# EAGLE schematic BMS_Slave (EAGLE 7.2.0)

## Sheet 1 of 5
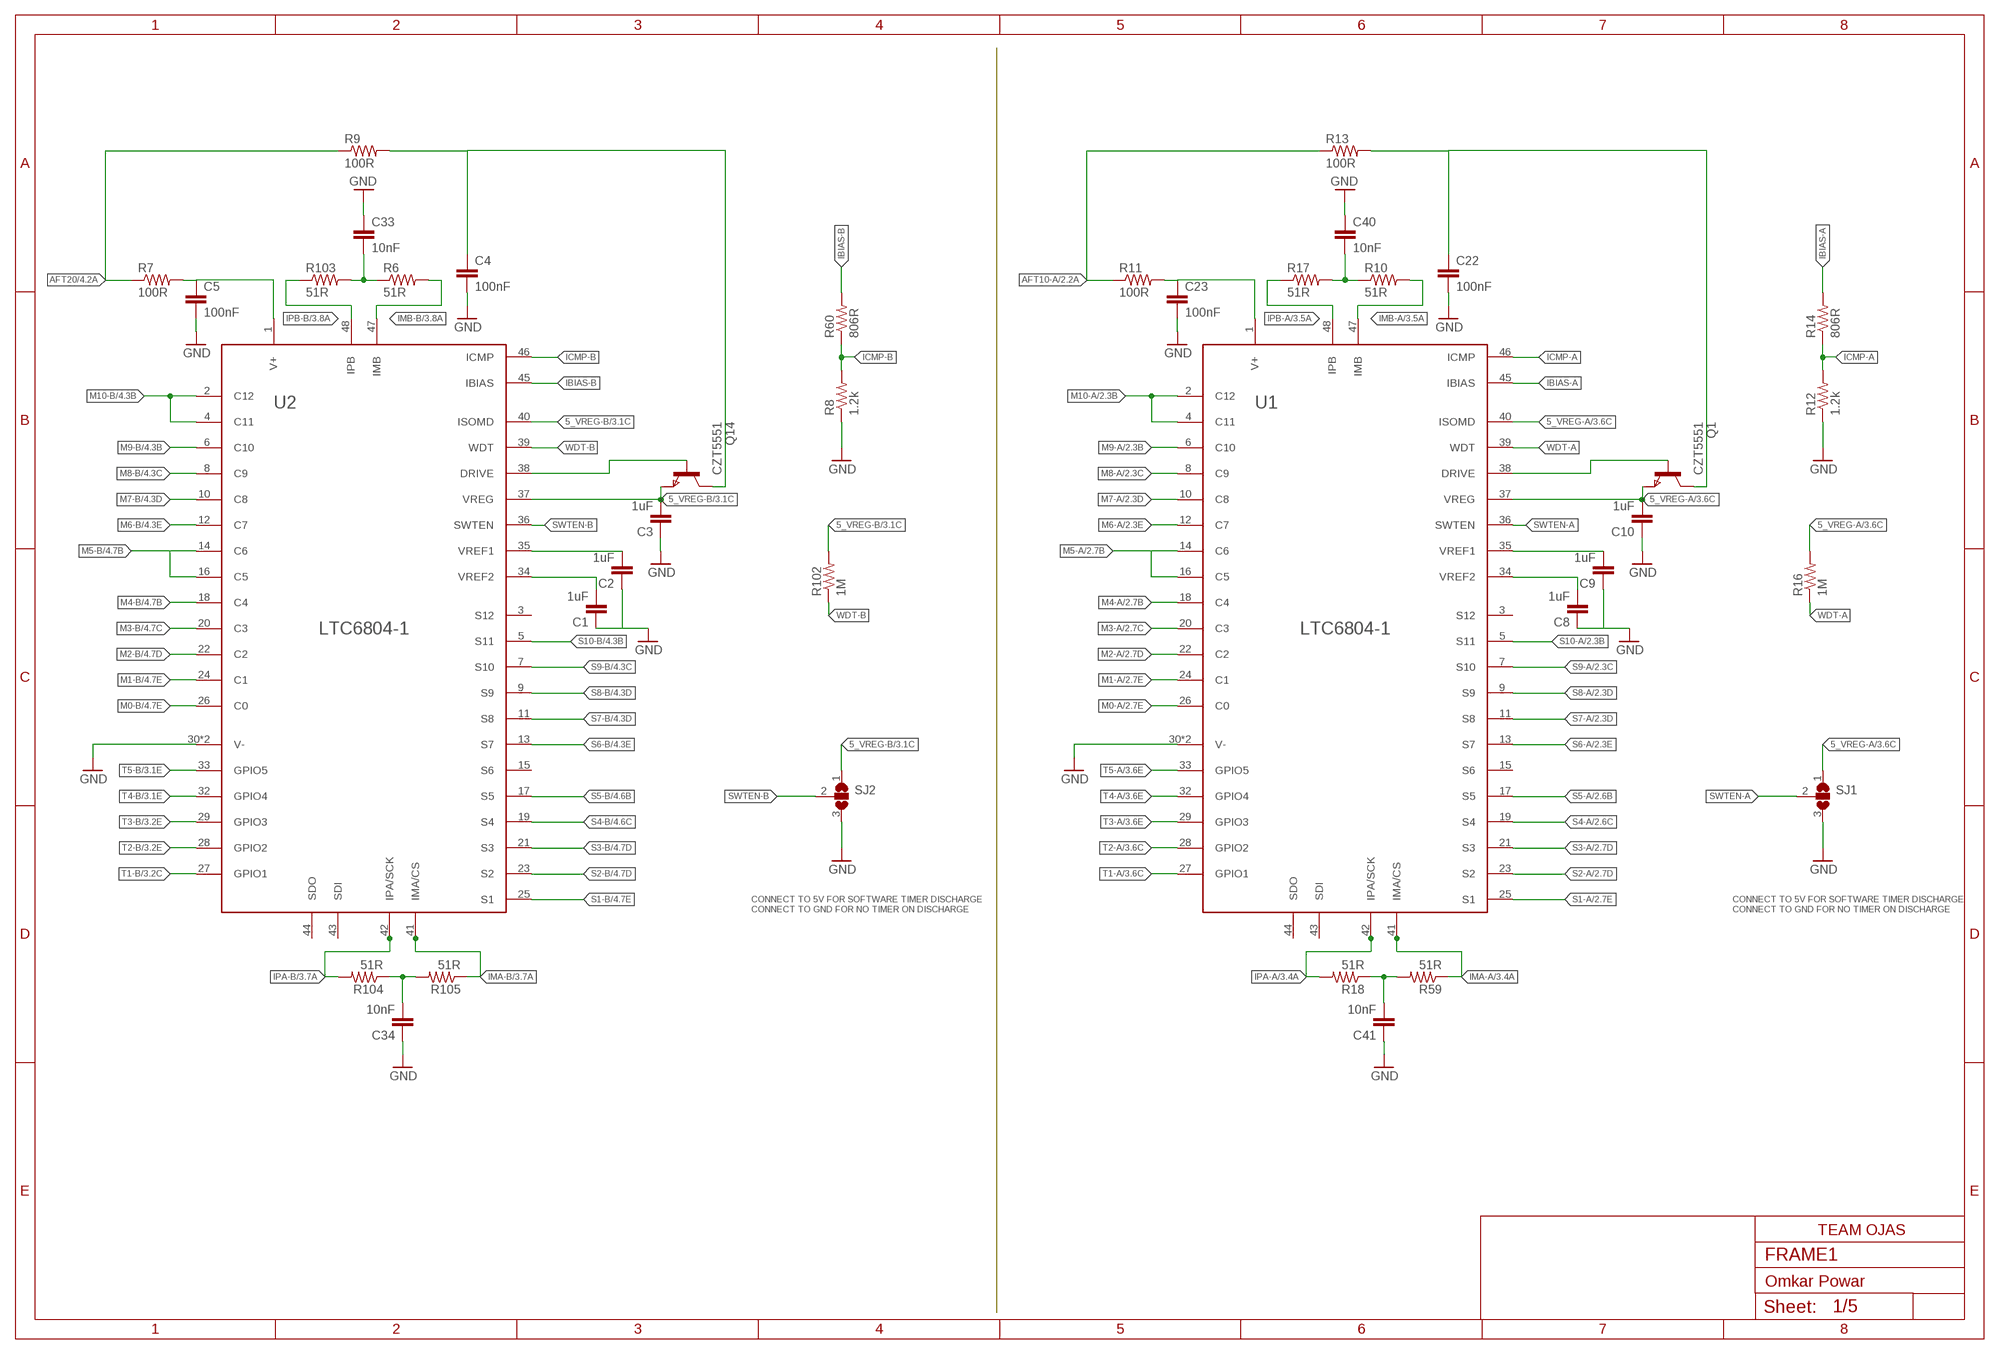
[diagram p0: schematic, sheet 1]

### Parts
C1  1uF  C0603  [0603]
C2  1uF  C0603  [0603]
C3  1uF  C0603  [0603]
C4  100nF  C0805  [0805]
C5  100nF  C0805  [0805]
C8  1uF  C0603  [0603]
C9  1uF  C0603  [0603]
C10  1uF  C0603  [0603]
C22  100nF  C0805  [0805]
C23  100nF  C0805  [0805]
C33  10nF  C0805  [0805]
C34  10nF  C0805  [0805]
C40  10nF  C0805  [0805]
C41  10nF  C0805  [0805]
Q1  CZT5551  NSV1C201MZ4  [SOT223]
Q14  CZT5551  NSV1C201MZ4  [SOT223]
R6  51R  R0603  [0603]
R7  100R  R0603  [0603]
R8  1.2k  R0603  [0603]
R9  100R  R0603  [0603]
R10  51R  R0603  [0603]
R11  100R  R0603  [0603]
R12  1.2k  R0603  [0603]
R13  100R  R0603  [0603]
R14  806R  R0603  [0603]
R16  1M  R0603  [0603]
R17  51R  R0603  [0603]
R18  51R  R0603  [0603]
R59  51R  R0603  [0603]
R60  806R  R0603  [0603]
R102  1M  R0603  [0603]
R103  51R  R0603  [0603]
R104  51R  R0603  [0603]
R105  51R  R0603  [0603]
SJ1  SJ2W  [SJ_2]
SJ2  SJ2W  [SJ_2]
U1  LTC6804  [48-LEAD_SSOP]
U2  LTC6804  [48-LEAD_SSOP]

### Nets
5_VREG-A: C10.P$2 Q1.3(E) R16.P$2 SJ1.1 U1.37(VREG) U1.40(ISOMD) ; also sheet 3
5_VREG-B: C3.P$2 Q14.3(E) R102.P$2 SJ2.1 U2.37(VREG) U2.40(ISOMD) ; also sheet 3
AFT10-A: R11.P$1 R13.P$1 ; also sheet 2
AFT20: R7.P$1 R9.P$1 ; also sheet 4
GNDA: C8.P$1 C9.P$1 C10.P$1 C22.P$2 C23.P$2 C40.P$1 C41.P$1 R12.P$1 SJ1.3 U1.30(V-) U1.31(V-) ; supply symbol labelled GND ; also sheet 2,3
GNDB: C1.P$1 C2.P$1 C3.P$1 C4.P$2 C5.P$2 C33.P$1 C34.P$1 R8.P$1 SJ2.3 U2.30(V-) U2.31(V-) ; supply symbol labelled GND ; also sheet 3,4
IBIAS-A: R14.P$2 U1.45(IBIAS)
IBIAS-B: R60.P$2 U2.45(IBIAS)
ICMP-A: R12.P$2 R14.P$1 U1.46(ICMP)
ICMP-B: R8.P$2 R60.P$1 U2.46(ICMP)
IMA-A: R59.P$1 U1.41(IMA/CS) ; also sheet 3
IMA-B: R105.P$1 U2.41(IMA/CS) ; also sheet 3
IMB-A: R10.P$2 U1.47(IMB) ; also sheet 3
IMB-B: R6.P$2 U2.47(IMB) ; also sheet 3
IPA-A: R18.P$2 U1.42(IPA/SCK) ; also sheet 3
IPA-B: R104.P$2 U2.42(IPA/SCK) ; also sheet 3
IPB-A: R17.P$1 U1.48(IPB) ; also sheet 3
IPB-B: R103.P$1 U2.48(IPB) ; also sheet 3
M0-A: U1.26(C0) ; also sheet 2
M0-B: U2.26(C0) ; also sheet 4
M1-A: U1.24(C1) ; also sheet 2
M1-B: U2.24(C1) ; also sheet 4
M2-A: U1.22(C2) ; also sheet 2
M2-B: U2.22(C2) ; also sheet 4
M3-A: U1.20(C3) ; also sheet 2
M3-B: U2.20(C3) ; also sheet 4
M4-A: U1.18(C4) ; also sheet 2
M4-B: U2.18(C4) ; also sheet 4
M5-A: U1.14(C6) U1.16(C5) ; also sheet 2
M5-B: U2.14(C6) U2.16(C5) ; also sheet 4
M6-A: U1.12(C7) ; also sheet 2
M6-B: U2.12(C7) ; also sheet 4
M7-A: U1.10(C8) ; also sheet 2
M7-B: U2.10(C8) ; also sheet 4
M8-A: U1.8(C9) ; also sheet 2
M8-B: U2.8(C9) ; also sheet 4
M9-A: U1.6(C10) ; also sheet 2
M9-B: U2.6(C10) ; also sheet 4
M10-A: U1.2(C12) U1.4(C11) ; also sheet 2
M10-B: U2.2(C12) U2.4(C11) ; also sheet 4
N$1: C5.P$1 R7.P$2 U2.1(V+)
N$2: C9.P$2 U1.35(VREF1)
N$3: C8.P$2 U1.34(VREF2)
N$11: Q14.1(B) U2.38(DRIVE)
N$12: C4.P$1 Q14.2(C) Q14.4(C) R9.P$2
N$15: C2.P$2 U2.35(VREF1)
N$16: C1.P$2 U2.34(VREF2)
N$17: C33.P$2 R6.P$1 R103.P$2
N$18: C40.P$2 R10.P$1 R17.P$2
N$19: C34.P$2 R104.P$1 R105.P$2
N$20: C41.P$2 R18.P$1 R59.P$2
N$36: Q1.1(B) U1.38(DRIVE)
N$49: C22.P$1 Q1.2(C) Q1.4(C) R13.P$2
N$66: C23.P$1 R11.P$2 U1.1(V+)
S1-A: U1.25(S1) ; also sheet 2
S1-B: U2.25(S1) ; also sheet 4
S2-A: U1.23(S2) ; also sheet 2
S2-B: U2.23(S2) ; also sheet 4
S3-A: U1.21(S3) ; also sheet 2
S3-B: U2.21(S3) ; also sheet 4
S4-A: U1.19(S4) ; also sheet 2
S4-B: U2.19(S4) ; also sheet 4
S5-A: U1.17(S5) ; also sheet 2
S5-B: U2.17(S5) ; also sheet 4
S6-A: U1.13(S7) ; also sheet 2
S6-B: U2.13(S7) ; also sheet 4
S7-A: U1.11(S8) ; also sheet 2
S7-B: U2.11(S8) ; also sheet 4
S8-A: U1.9(S9) ; also sheet 2
S8-B: U2.9(S9) ; also sheet 4
S9-A: U1.7(S10) ; also sheet 2
S9-B: U2.7(S10) ; also sheet 4
S10-A: U1.5(S11) ; also sheet 2
S10-B: U2.5(S11) ; also sheet 4
SWTEN-A: SJ1.2 U1.36(SWTEN)
SWTEN-B: SJ2.2 U2.36(SWTEN)
T1-A: U1.27(GPIO1) ; also sheet 3
T1-B: U2.27(GPIO1) ; also sheet 3
T2-A: U1.28(GPIO2) ; also sheet 3
T2-B: U2.28(GPIO2) ; also sheet 3
T3-A: U1.29(GPIO3) ; also sheet 3
T3-B: U2.29(GPIO3) ; also sheet 3
T4-A: U1.32(GPIO4) ; also sheet 3
T4-B: U2.32(GPIO4) ; also sheet 3
T5-A: U1.33(GPIO5) ; also sheet 3
T5-B: U2.33(GPIO5) ; also sheet 3
WDT-A: R16.P$1 U1.39(WDT)
WDT-B: R102.P$1 U2.39(WDT)
Unconnected: U1.3(S12) U1.15(S6) U1.43(SDI) U1.44(SDO) U2.3(S12) U2.15(S6) U2.43(SDI) U2.44(SDO)

### Notes on the sheet
- CONNECT TO 5V FOR SOFTWARE TIMER DISCHARGE
  CONNECT TO GND FOR NO TIMER ON DISCHARGE
- CONNECT TO 5V FOR SOFTWARE TIMER DISCHARGE
  CONNECT TO GND FOR NO TIMER ON DISCHARGE

## Sheet 2 of 5
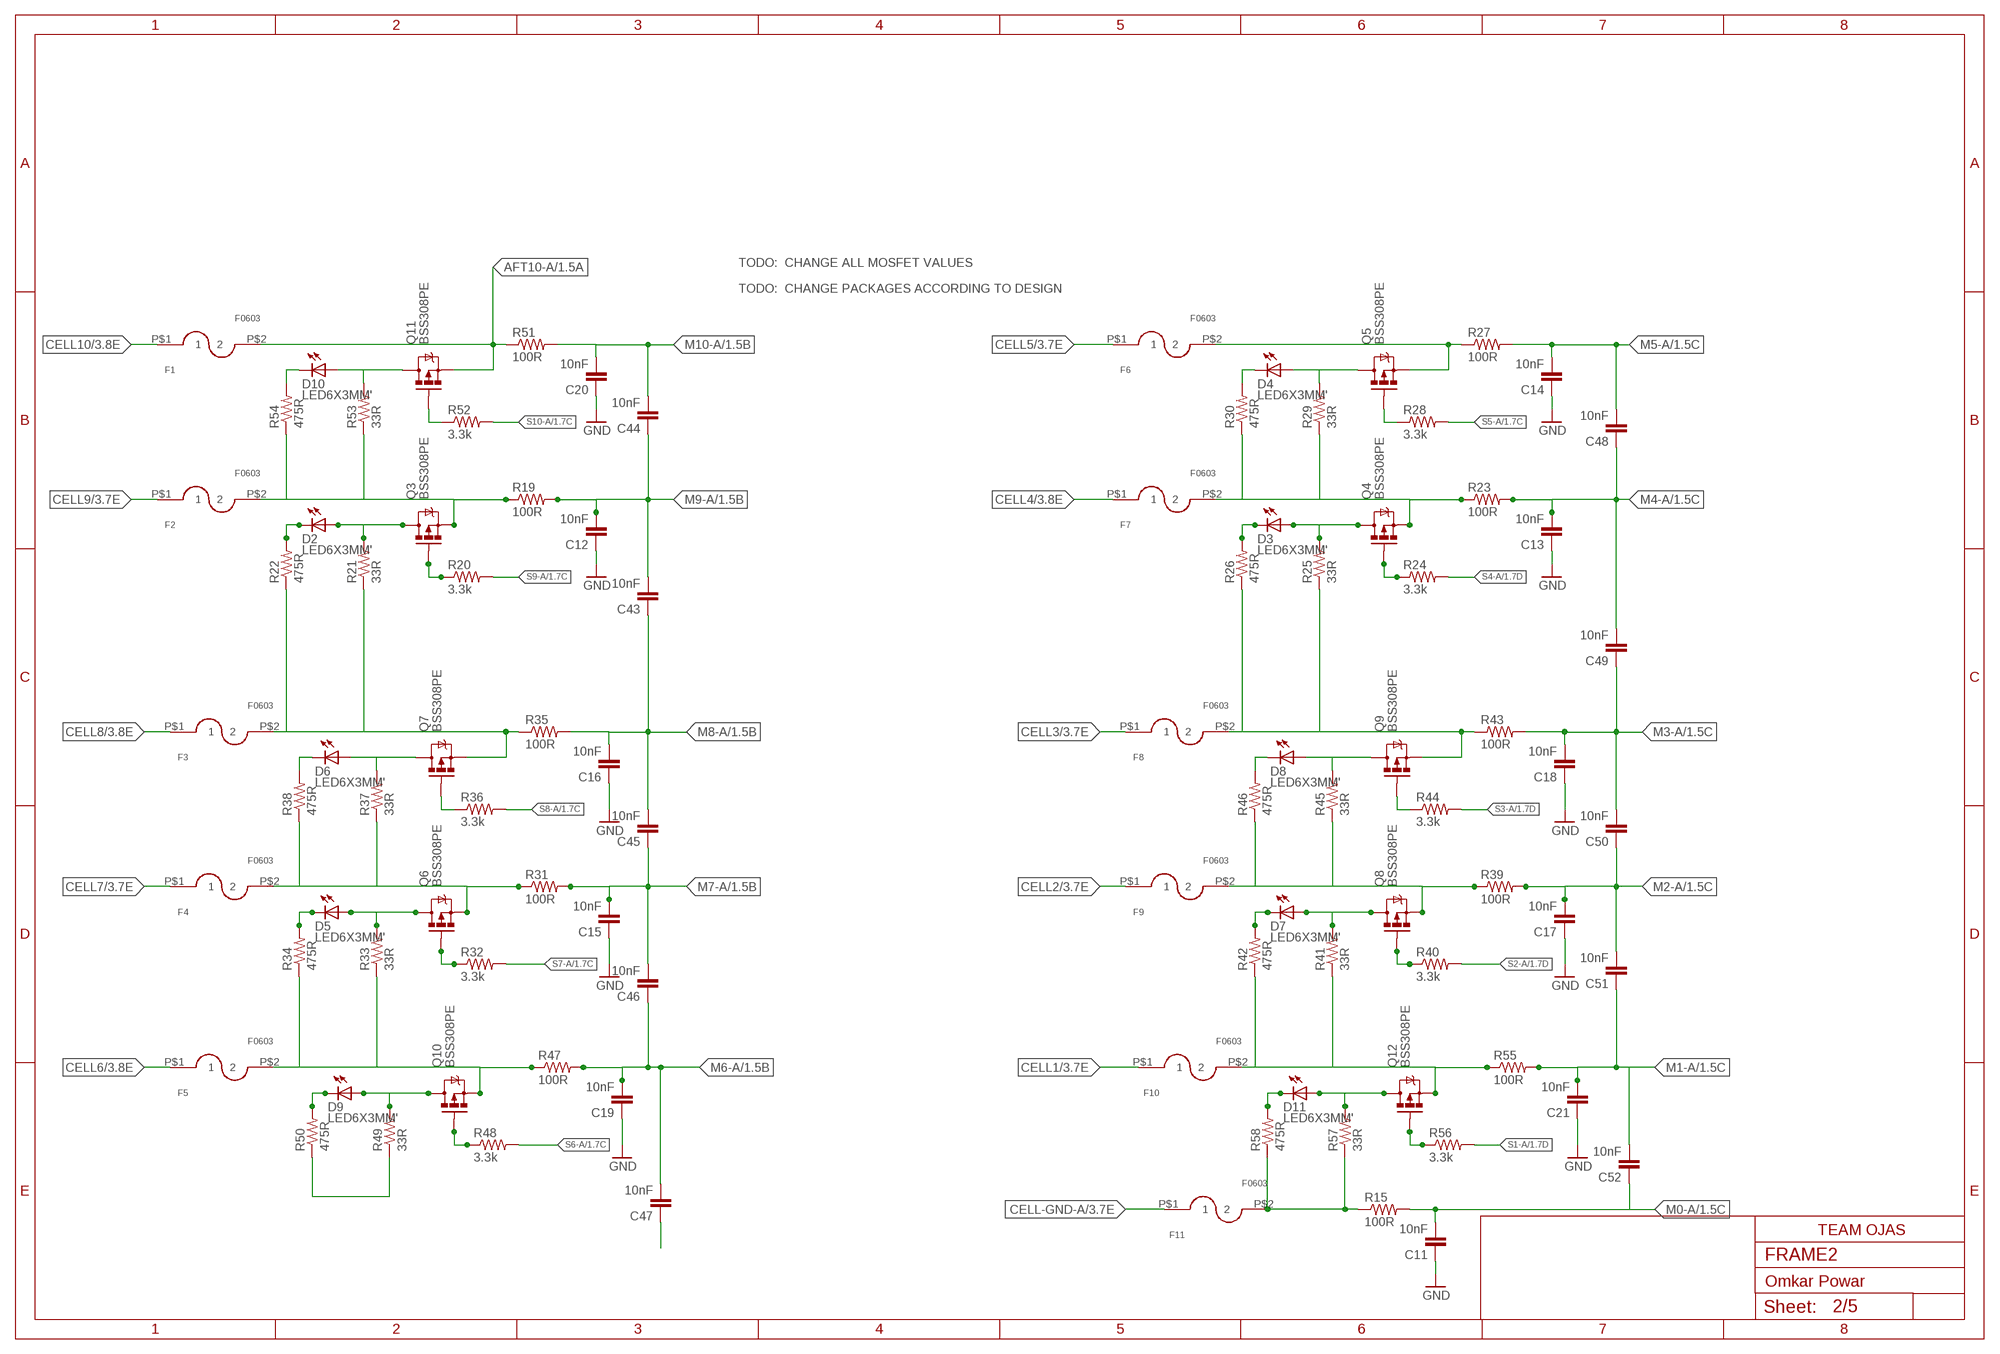
[diagram p1: schematic, sheet 2]

### Parts
C11  10nF  C0603  [0603]
C12  10nF  C0603  [0603]
C13  10nF  C0603  [0603]
C14  10nF  C0603  [0603]
C15  10nF  C0603  [0603]
C16  10nF  C0603  [0603]
C17  10nF  C0603  [0603]
C18  10nF  C0603  [0603]
C19  10nF  C0603  [0603]
C20  10nF  C0603  [0603]
C21  10nF  C0603  [0603]
C43  10nF  C0603  [0603]
C44  10nF  C0603  [0603]
C45  10nF  C0603  [0603]
C46  10nF  C0603  [0603]
C47  10nF  C0603  [0603]
C48  10nF  C0603  [0603]
C49  10nF  C0603  [0603]
C50  10nF  C0603  [0603]
C51  10nF  C0603  [0603]
C52  10nF  C0603  [0603]
D2  LED6X3MM'  [LED0603]
D3  LED6X3MM'  [LED0603]
D4  LED6X3MM'  [LED0603]
D5  LED6X3MM'  [LED0603]
D6  LED6X3MM'  [LED0603]
D7  LED6X3MM'  [LED0603]
D8  LED6X3MM'  [LED0603]
D9  LED6X3MM'  [LED0603]
D10  LED6X3MM'  [LED0603]
D11  LED6X3MM'  [LED0603]
F1  F0603  [0603]
F2  F0603  [0603]
F3  F0603  [0603]
F4  F0603  [0603]
F5  F0603  [0603]
F6  F0603  [0603]
F7  F0603  [0603]
F8  F0603  [0603]
F9  F0603  [0603]
F10  F0603  [0603]
F11  F0603  [0603]
Q3  BSS308PE  MOSFET-P_CHANNEL  [SOT23-3]
Q4  BSS308PE  MOSFET-P_CHANNEL  [SOT23-3]
Q5  BSS308PE  MOSFET-P_CHANNEL  [SOT23-3]
Q6  BSS308PE  MOSFET-P_CHANNEL  [SOT23-3]
Q7  BSS308PE  MOSFET-P_CHANNEL  [SOT23-3]
Q8  BSS308PE  MOSFET-P_CHANNEL  [SOT23-3]
Q9  BSS308PE  MOSFET-P_CHANNEL  [SOT23-3]
Q10  BSS308PE  MOSFET-P_CHANNEL  [SOT23-3]
Q11  BSS308PE  MOSFET-P_CHANNEL  [SOT23-3]
Q12  BSS308PE  MOSFET-P_CHANNEL  [SOT23-3]
R15  100R  R0603  [0603]
R19  100R  R0603  [0603]
R20  3.3k  R0603  [0603]
R21  33R  R2512  [2512]
R22  475R  R0603  [0603]
R23  100R  R0603  [0603]
R24  3.3k  R0603  [0603]
R25  33R  R2512  [2512]
R26  475R  R0603  [0603]
R27  100R  R0603  [0603]
R28  3.3k  R0603  [0603]
R29  33R  R2512  [2512]
R30  475R  R0603  [0603]
R31  100R  R0603  [0603]
R32  3.3k  R0603  [0603]
R33  33R  R2512  [2512]
R34  475R  R0603  [0603]
R35  100R  R0603  [0603]
R36  3.3k  R0603  [0603]
R37  33R  R2512  [2512]
R38  475R  R0603  [0603]
R39  100R  R0603  [0603]
R40  3.3k  R0603  [0603]
R41  33R  R2512  [2512]
R42  475R  R0603  [0603]
R43  100R  R0603  [0603]
R44  3.3k  R0603  [0603]
R45  33R  R2512  [2512]
R46  475R  R0603  [0603]
R47  100R  R0603  [0603]
R48  3.3k  R0603  [0603]
R49  33R  R2512  [2512]
R50  475R  R0603  [0603]
R51  100R  R0603  [0603]
R52  3.3k  R0603  [0603]
R53  33R  R2512  [2512]
R54  475R  R0603  [0603]
R55  100R  R0603  [0603]
R56  3.3k  R0603  [0603]
R57  33R  R2512  [2512]
R58  475R  R0603  [0603]

### Nets
AFT0: F11.P$2 R15.P$1 R57.1 R58.P$1
AFT1: F10.P$2 Q12.2(S) R41.1 R42.P$1 R55.P$1
AFT2: F9.P$2 Q8.2(S) R39.P$1 R45.1 R46.P$1
AFT3: F8.P$2 Q9.2(S) R25.1 R26.P$1 R43.P$1
AFT4: F7.P$2 Q4.2(S) R23.P$1 R29.1 R30.P$1
AFT5: F6.P$2 Q5.2(S) R27.P$1 R49.1 R50.P$1
AFT6: F5.P$2 Q10.2(S) R33.1 R34.P$1 R47.P$1
AFT7: F4.P$2 Q6.2(S) R31.P$1 R37.1 R38.P$1
AFT8: F3.P$2 Q7.2(S) R21.1 R22.P$1 R35.P$1
AFT9: F2.P$2 Q3.2(S) R19.P$1 R53.1 R54.P$1
AFT10-A: F1.P$2 Q11.2(S) R51.P$1 ; also sheet 1
CELL1: F10.P$1 ; also sheet 3
CELL2: F9.P$1 ; also sheet 3
CELL3: F8.P$1 ; also sheet 3
CELL4: F7.P$1 ; also sheet 3
CELL5: F6.P$1 ; also sheet 3
CELL6: F5.P$1 ; also sheet 3
CELL7: F4.P$1 ; also sheet 3
CELL8: F3.P$1 ; also sheet 3
CELL9: F2.P$1 ; also sheet 3
CELL10: F1.P$1 ; also sheet 3
CELL-GND-A: F11.P$1 ; also sheet 3
GNDA: C11.P$1 C12.P$1 C13.P$1 C14.P$1 C15.P$1 C16.P$1 C17.P$1 C18.P$1 C19.P$1 C20.P$1 C21.P$1 ; supply symbol labelled GND ; also sheet 1,3
M0-A: C11.P$2 C52.P$1 R15.P$2 ; also sheet 1
M1-A: C21.P$2 C51.P$1 C52.P$2 R55.P$2 ; also sheet 1
M2-A: C17.P$2 C50.P$1 C51.P$2 R39.P$2 ; also sheet 1
M3-A: C18.P$2 C49.P$1 C50.P$2 R43.P$2 ; also sheet 1
M4-A: C13.P$2 C48.P$1 C49.P$2 R23.P$2 ; also sheet 1
M5-A: C14.P$2 C47.P$1 C48.P$2 R27.P$2 ; also sheet 1
M6-A: C19.P$2 C46.P$1 C47.P$2 R47.P$2 ; also sheet 1
M7-A: C15.P$2 C45.P$1 C46.P$2 R31.P$2 ; also sheet 1
M8-A: C16.P$2 C43.P$1 C45.P$2 R35.P$2 ; also sheet 1
M9-A: C12.P$2 C43.P$2 C44.P$1 R19.P$2 ; also sheet 1
M10-A: C20.P$2 C44.P$2 R51.P$2 ; also sheet 1
N$70: D2.P$1(A) Q3.3(D) R21.2
N$71: D2.P$2(C) R22.P$2
N$72: Q3.1(G) R20.P$1
N$75: D3.P$1(A) Q4.3(D) R25.2
N$76: D3.P$2(C) R26.P$2
N$77: Q4.1(G) R24.P$1
N$80: D4.P$1(A) Q5.3(D) R29.2
N$81: D4.P$2(C) R30.P$2
N$82: Q5.1(G) R28.P$1
N$212: D5.P$1(A) Q6.3(D) R33.2
N$213: D5.P$2(C) R34.P$2
N$214: Q6.1(G) R32.P$1
N$217: D6.P$1(A) Q7.3(D) R37.2
N$218: D6.P$2(C) R38.P$2
N$219: Q7.1(G) R36.P$1
N$223: D7.P$1(A) Q8.3(D) R41.2
N$224: D7.P$2(C) R42.P$2
N$225: Q8.1(G) R40.P$1
N$228: D8.P$1(A) Q9.3(D) R45.2
N$229: D8.P$2(C) R46.P$2
N$230: Q9.1(G) R44.P$1
N$236: D10.P$1(A) Q11.3(D) R53.2
N$237: D10.P$2(C) R54.P$2
N$238: Q11.1(G) R52.P$1
N$239: D9.P$1(A) Q10.3(D) R49.2
N$240: D9.P$2(C) R50.P$2
N$241: Q10.1(G) R48.P$1
N$245: D11.P$1(A) Q12.3(D) R57.2
N$246: D11.P$2(C) R58.P$2
N$247: Q12.1(G) R56.P$1
S1-A: R56.P$2 ; also sheet 1
S2-A: R40.P$2 ; also sheet 1
S3-A: R44.P$2 ; also sheet 1
S4-A: R24.P$2 ; also sheet 1
S5-A: R28.P$2 ; also sheet 1
S6-A: R48.P$2 ; also sheet 1
S7-A: R32.P$2 ; also sheet 1
S8-A: R36.P$2 ; also sheet 1
S9-A: R20.P$2 ; also sheet 1
S10-A: R52.P$2 ; also sheet 1

### Notes on the sheet
- TODO:  CHANGE ALL MOSFET VALUES
- TODO:  CHANGE PACKAGES ACCORDING TO DESIGN

## Sheet 3 of 5
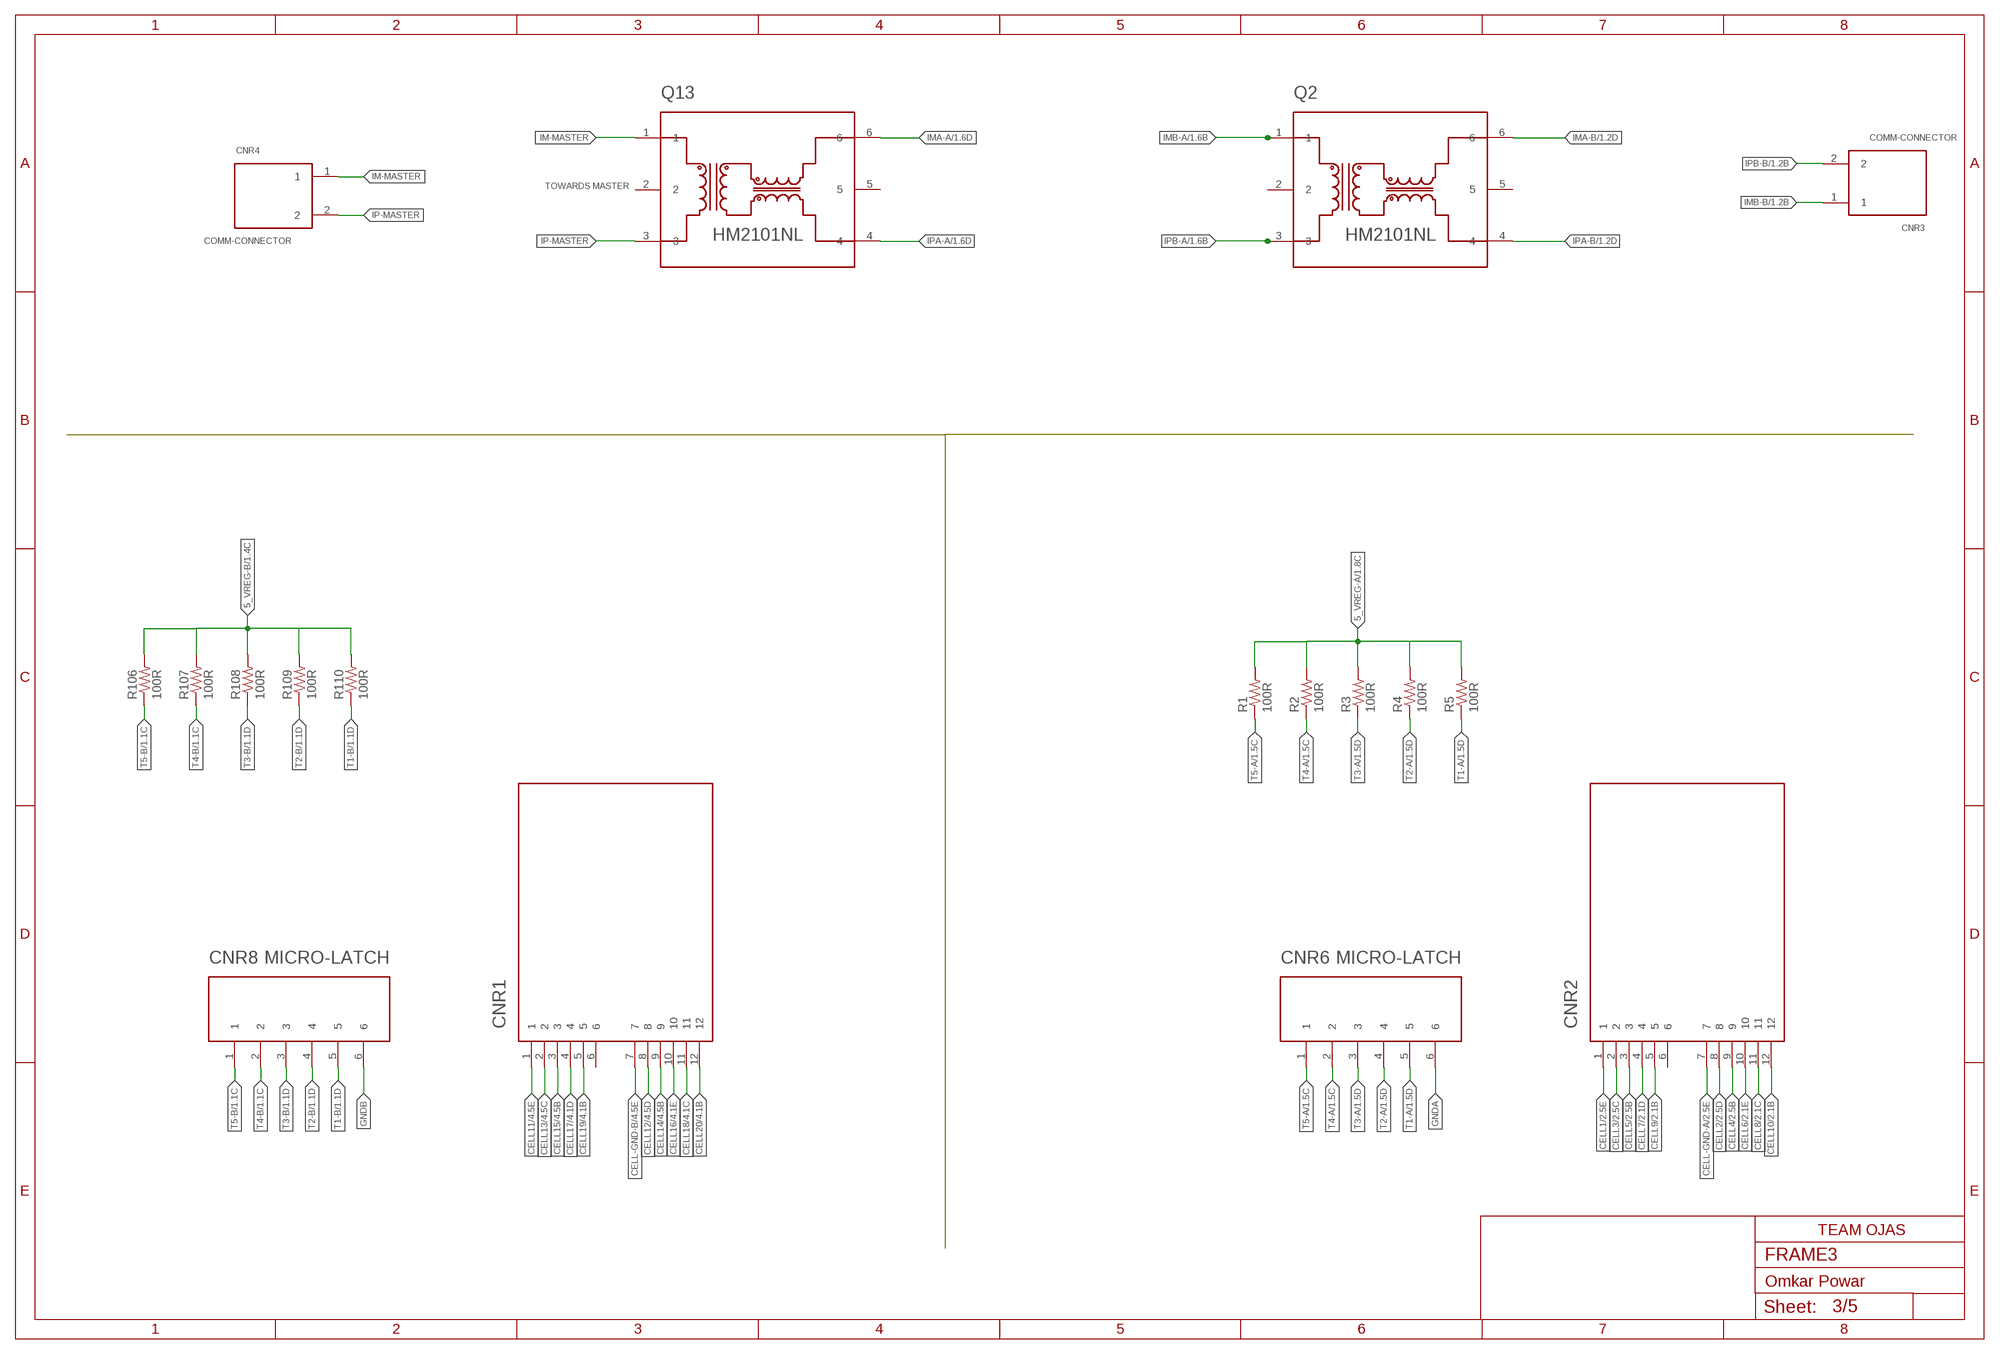
[diagram p2: schematic, sheet 3]

### Parts
CNR1  CELL-CONNECTORMOLEX-MICROFIT  [0430451200]
CNR2  CELL-CONNECTORMOLEX-MICROFIT  [0430451200]
CNR3  COMM-CONNECTOR  [105313-2202]
CNR4  COMM-CONNECTOR  [105313-2202]
CNR6  MICRO-LATCH  TEMP-6-CONNECTORMICRO-LATCH  [0532530670]
CNR8  MICRO-LATCH  TEMP-6-CONNECTORMICRO-LATCH  [0532530670]
Q2  HM2101NL  [HM2101NL]
Q13  HM2101NL  [HM2101NL]
R1  100R  R0603  [0603]
R2  100R  R0603  [0603]
R3  100R  R0603  [0603]
R4  100R  R0603  [0603]
R5  100R  R0603  [0603]
R106  100R  R0603  [0603]
R107  100R  R0603  [0603]
R108  100R  R0603  [0603]
R109  100R  R0603  [0603]
R110  100R  R0603  [0603]

### Nets
5_VREG-A: R1.P$2 R2.P$2 R3.P$2 R4.P$2 R5.P$2 ; also sheet 1
5_VREG-B: R106.P$2 R107.P$2 R108.P$2 R109.P$2 R110.P$2 ; also sheet 1
CELL1: CNR2.1 ; also sheet 2
CELL2: CNR2.8 ; also sheet 2
CELL3: CNR2.2 ; also sheet 2
CELL4: CNR2.9 ; also sheet 2
CELL5: CNR2.3 ; also sheet 2
CELL6: CNR2.10 ; also sheet 2
CELL7: CNR2.4 ; also sheet 2
CELL8: CNR2.11 ; also sheet 2
CELL9: CNR2.5 ; also sheet 2
CELL10: CNR2.12 ; also sheet 2
CELL11: CNR1.1 ; also sheet 4
CELL12: CNR1.8 ; also sheet 4
CELL13: CNR1.2 ; also sheet 4
CELL14: CNR1.9 ; also sheet 4
CELL15: CNR1.3 ; also sheet 4
CELL16: CNR1.10 ; also sheet 4
CELL17: CNR1.4 ; also sheet 4
CELL18: CNR1.11 ; also sheet 4
CELL19: CNR1.5 ; also sheet 4
CELL20: CNR1.12 ; also sheet 4
CELL-GND-A: CNR2.7 ; also sheet 2
CELL-GND-B: CNR1.7 ; also sheet 4
GNDA: CNR6.6 ; also sheet 1,2
GNDB: CNR8.6 ; also sheet 1,4
IM-MASTER: CNR4.1 Q13.1
IMA-A: Q13.6 ; also sheet 1
IMA-B: Q2.6 ; also sheet 1
IMB-A: Q2.1 ; also sheet 1
IMB-B: CNR3.1 ; also sheet 1
IP-MASTER: CNR4.2 Q13.3
IPA-A: Q13.4 ; also sheet 1
IPA-B: Q2.4 ; also sheet 1
IPB-A: Q2.3 ; also sheet 1
IPB-B: CNR3.2 ; also sheet 1
T1-A: CNR6.5 R5.P$1 ; also sheet 1
T1-B: CNR8.5 R110.P$1 ; also sheet 1
T2-A: CNR6.4 R4.P$1 ; also sheet 1
T2-B: CNR8.4 R109.P$1 ; also sheet 1
T3-A: CNR6.3 R3.P$1 ; also sheet 1
T3-B: CNR8.3 R108.P$1 ; also sheet 1
T4-A: CNR6.2 R2.P$1 ; also sheet 1
T4-B: CNR8.2 R107.P$1 ; also sheet 1
T5-A: CNR6.1 R1.P$1 ; also sheet 1
T5-B: CNR8.1 R106.P$1 ; also sheet 1
Unconnected: CNR1.6 CNR2.6 Q2.2 Q2.5 Q13.2 Q13.5

### Notes on the sheet
- TOWARDS MASTER

## Sheet 4 of 5
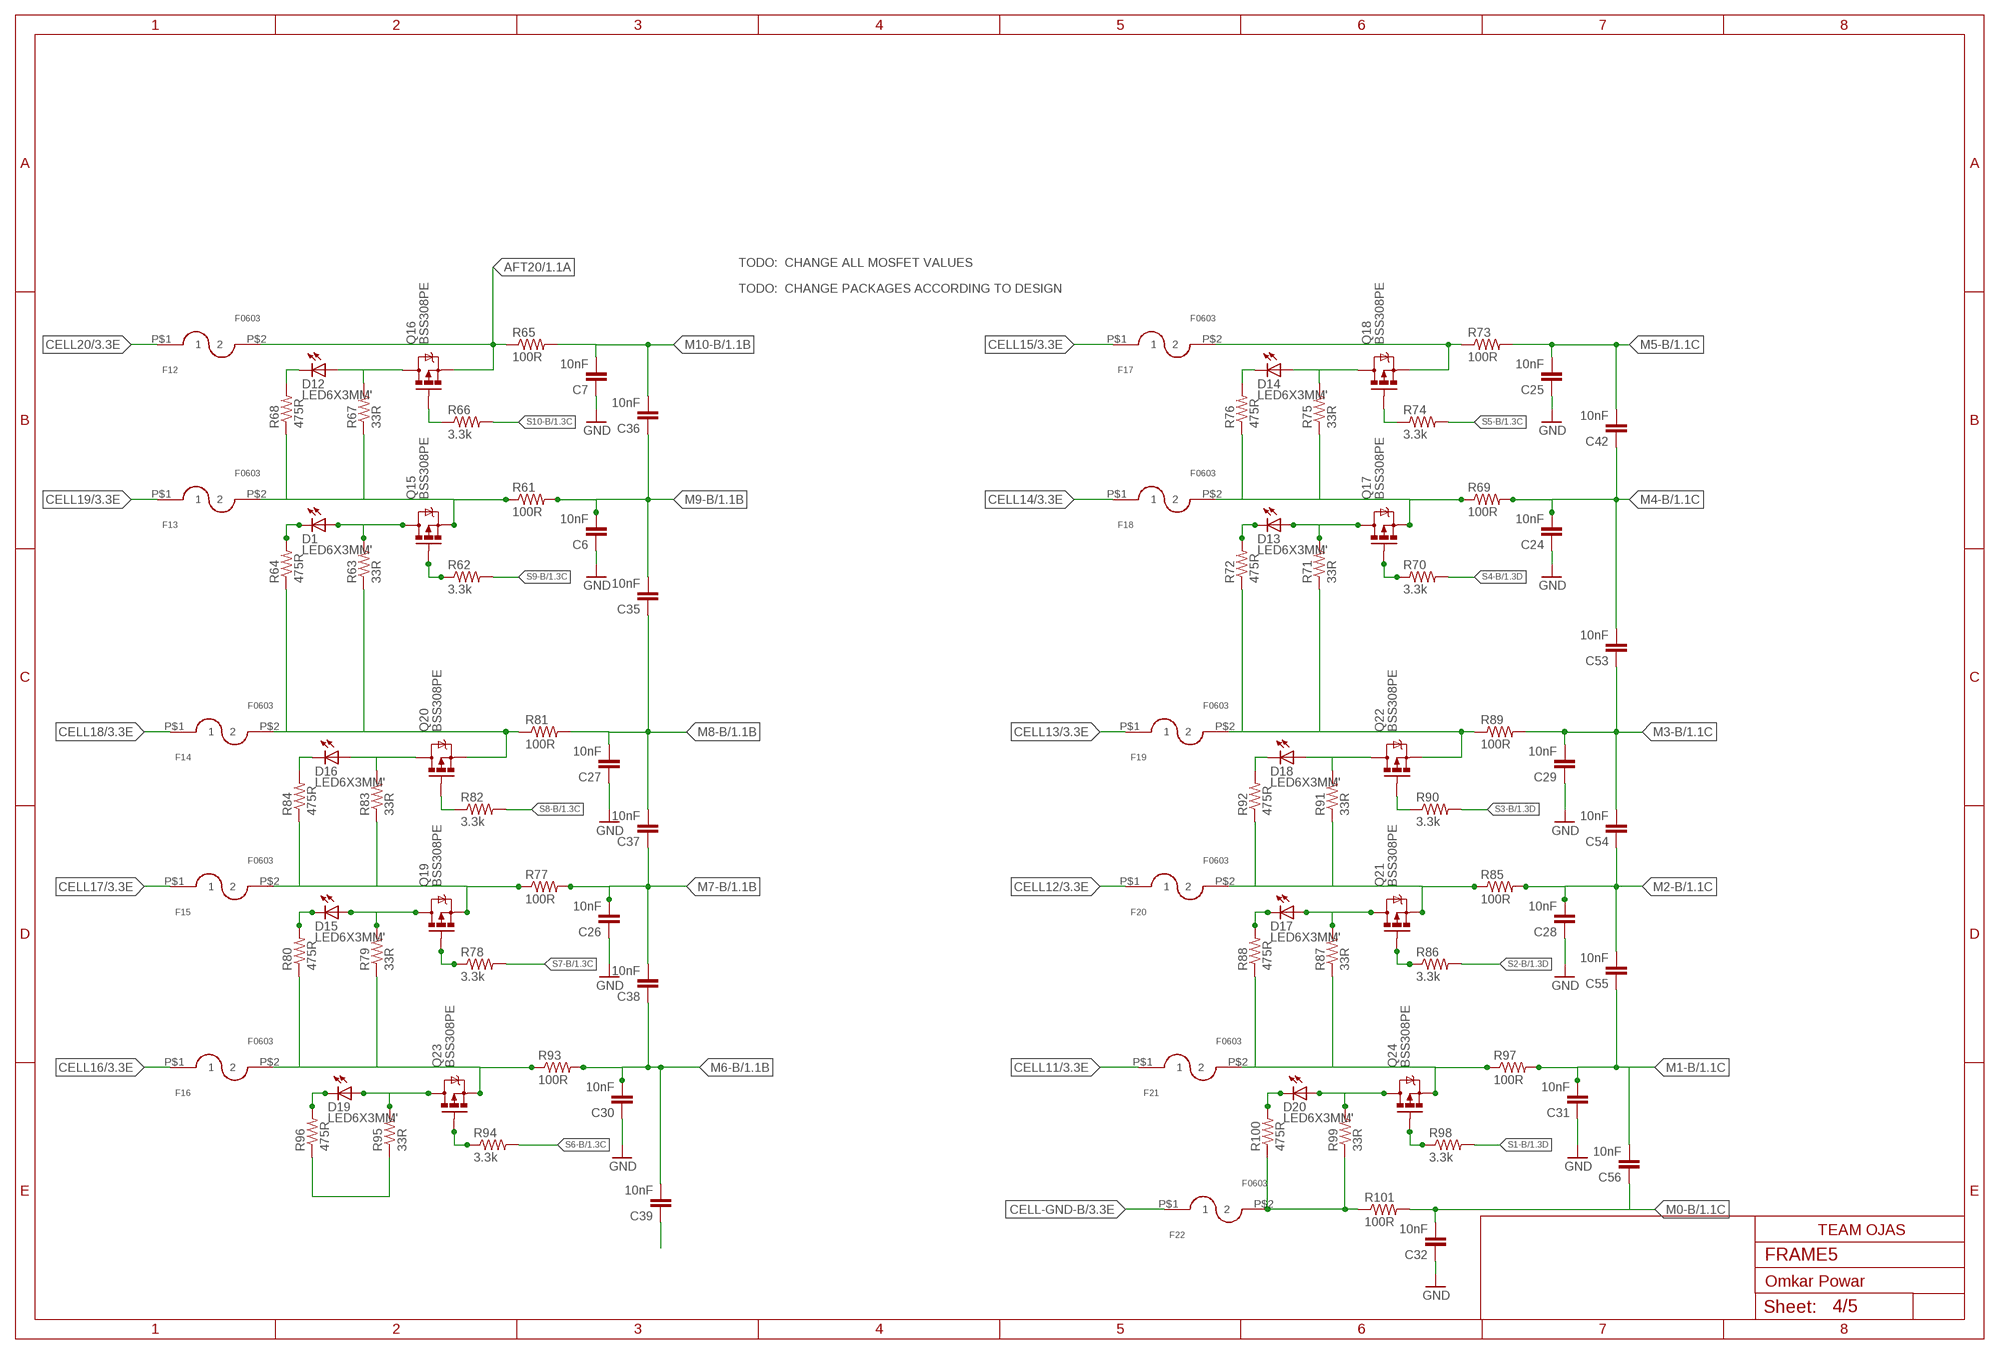
[diagram p3: schematic, sheet 4]

### Parts
C6  10nF  C0603  [0603]
C7  10nF  C0603  [0603]
C24  10nF  C0603  [0603]
C25  10nF  C0603  [0603]
C26  10nF  C0603  [0603]
C27  10nF  C0603  [0603]
C28  10nF  C0603  [0603]
C29  10nF  C0603  [0603]
C30  10nF  C0603  [0603]
C31  10nF  C0603  [0603]
C32  10nF  C0603  [0603]
C35  10nF  C0603  [0603]
C36  10nF  C0603  [0603]
C37  10nF  C0603  [0603]
C38  10nF  C0603  [0603]
C39  10nF  C0603  [0603]
C42  10nF  C0603  [0603]
C53  10nF  C0603  [0603]
C54  10nF  C0603  [0603]
C55  10nF  C0603  [0603]
C56  10nF  C0603  [0603]
D1  LED6X3MM'  [LED0603]
D12  LED6X3MM'  [LED0603]
D13  LED6X3MM'  [LED0603]
D14  LED6X3MM'  [LED0603]
D15  LED6X3MM'  [LED0603]
D16  LED6X3MM'  [LED0603]
D17  LED6X3MM'  [LED0603]
D18  LED6X3MM'  [LED0603]
D19  LED6X3MM'  [LED0603]
D20  LED6X3MM'  [LED0603]
F12  F0603  [0603]
F13  F0603  [0603]
F14  F0603  [0603]
F15  F0603  [0603]
F16  F0603  [0603]
F17  F0603  [0603]
F18  F0603  [0603]
F19  F0603  [0603]
F20  F0603  [0603]
F21  F0603  [0603]
F22  F0603  [0603]
Q15  BSS308PE  MOSFET-P_CHANNEL  [SOT23-3]
Q16  BSS308PE  MOSFET-P_CHANNEL  [SOT23-3]
Q17  BSS308PE  MOSFET-P_CHANNEL  [SOT23-3]
Q18  BSS308PE  MOSFET-P_CHANNEL  [SOT23-3]
Q19  BSS308PE  MOSFET-P_CHANNEL  [SOT23-3]
Q20  BSS308PE  MOSFET-P_CHANNEL  [SOT23-3]
Q21  BSS308PE  MOSFET-P_CHANNEL  [SOT23-3]
Q22  BSS308PE  MOSFET-P_CHANNEL  [SOT23-3]
Q23  BSS308PE  MOSFET-P_CHANNEL  [SOT23-3]
Q24  BSS308PE  MOSFET-P_CHANNEL  [SOT23-3]
R61  100R  R0603  [0603]
R62  3.3k  R0603  [0603]
R63  33R  R2512  [2512]
R64  475R  R0603  [0603]
R65  100R  R0603  [0603]
R66  3.3k  R0603  [0603]
R67  33R  R2512  [2512]
R68  475R  R0603  [0603]
R69  100R  R0603  [0603]
R70  3.3k  R0603  [0603]
R71  33R  R2512  [2512]
R72  475R  R0603  [0603]
R73  100R  R0603  [0603]
R74  3.3k  R0603  [0603]
R75  33R  R2512  [2512]
R76  475R  R0603  [0603]
R77  100R  R0603  [0603]
R78  3.3k  R0603  [0603]
R79  33R  R2512  [2512]
R80  475R  R0603  [0603]
R81  100R  R0603  [0603]
R82  3.3k  R0603  [0603]
R83  33R  R2512  [2512]
R84  475R  R0603  [0603]
R85  100R  R0603  [0603]
R86  3.3k  R0603  [0603]
R87  33R  R2512  [2512]
R88  475R  R0603  [0603]
R89  100R  R0603  [0603]
R90  3.3k  R0603  [0603]
R91  33R  R2512  [2512]
R92  475R  R0603  [0603]
R93  100R  R0603  [0603]
R94  3.3k  R0603  [0603]
R95  33R  R2512  [2512]
R96  475R  R0603  [0603]
R97  100R  R0603  [0603]
R98  3.3k  R0603  [0603]
R99  33R  R2512  [2512]
R100  475R  R0603  [0603]
R101  100R  R0603  [0603]

### Nets
AFT10-B: F22.P$2 R99.1 R100.P$1 R101.P$1
AFT11: F21.P$2 Q24.2(S) R87.1 R88.P$1 R97.P$1
AFT12: F20.P$2 Q21.2(S) R85.P$1 R91.1 R92.P$1
AFT13: F19.P$2 Q22.2(S) R71.1 R72.P$1 R89.P$1
AFT14: F18.P$2 Q17.2(S) R69.P$1 R75.1 R76.P$1
AFT15: F17.P$2 Q18.2(S) R73.P$1 R95.1 R96.P$1
AFT16: F16.P$2 Q23.2(S) R79.1 R80.P$1 R93.P$1
AFT17: F15.P$2 Q19.2(S) R77.P$1 R83.1 R84.P$1
AFT18: F14.P$2 Q20.2(S) R63.1 R64.P$1 R81.P$1
AFT19: F13.P$2 Q15.2(S) R61.P$1 R67.1 R68.P$1
AFT20: F12.P$2 Q16.2(S) R65.P$1 ; also sheet 1
CELL11: F21.P$1 ; also sheet 3
CELL12: F20.P$1 ; also sheet 3
CELL13: F19.P$1 ; also sheet 3
CELL14: F18.P$1 ; also sheet 3
CELL15: F17.P$1 ; also sheet 3
CELL16: F16.P$1 ; also sheet 3
CELL17: F15.P$1 ; also sheet 3
CELL18: F14.P$1 ; also sheet 3
CELL19: F13.P$1 ; also sheet 3
CELL20: F12.P$1 ; also sheet 3
CELL-GND-B: F22.P$1 ; also sheet 3
GNDB: C6.P$1 C7.P$1 C24.P$1 C25.P$1 C26.P$1 C27.P$1 C28.P$1 C29.P$1 C30.P$1 C31.P$1 C32.P$1 ; supply symbol labelled GND ; also sheet 1,3
M0-B: C32.P$2 C56.P$1 R101.P$2 ; also sheet 1
M1-B: C31.P$2 C55.P$1 C56.P$2 R97.P$2 ; also sheet 1
M2-B: C28.P$2 C54.P$1 C55.P$2 R85.P$2 ; also sheet 1
M3-B: C29.P$2 C53.P$1 C54.P$2 R89.P$2 ; also sheet 1
M4-B: C24.P$2 C42.P$1 C53.P$2 R69.P$2 ; also sheet 1
M5-B: C25.P$2 C39.P$1 C42.P$2 R73.P$2 ; also sheet 1
M6-B: C30.P$2 C38.P$1 C39.P$2 R93.P$2 ; also sheet 1
M7-B: C26.P$2 C37.P$1 C38.P$2 R77.P$2 ; also sheet 1
M8-B: C27.P$2 C35.P$1 C37.P$2 R81.P$2 ; also sheet 1
M9-B: C6.P$2 C35.P$2 C36.P$1 R61.P$2 ; also sheet 1
M10-B: C7.P$2 C36.P$2 R65.P$2 ; also sheet 1
N$21: D1.P$1(A) Q15.3(D) R63.2
N$22: D1.P$2(C) R64.P$2
N$23: Q15.1(G) R62.P$1
N$25: D12.P$1(A) Q16.3(D) R67.2
N$32: D12.P$2(C) R68.P$2
N$63: Q16.1(G) R66.P$1
N$64: D13.P$1(A) Q17.3(D) R71.2
N$65: D13.P$2(C) R72.P$2
N$67: Q17.1(G) R70.P$1
N$68: D14.P$1(A) Q18.3(D) R75.2
N$69: D14.P$2(C) R76.P$2
N$73: Q18.1(G) R74.P$1
N$74: D15.P$1(A) Q19.3(D) R79.2
N$78: D15.P$2(C) R80.P$2
N$79: Q19.1(G) R78.P$1
N$83: D16.P$1(A) Q20.3(D) R83.2
N$84: D16.P$2(C) R84.P$2
N$211: Q20.1(G) R82.P$1
N$215: D17.P$1(A) Q21.3(D) R87.2
N$216: D17.P$2(C) R88.P$2
N$220: Q21.1(G) R86.P$1
N$221: D18.P$1(A) Q22.3(D) R91.2
N$222: D18.P$2(C) R92.P$2
N$226: Q22.1(G) R90.P$1
N$227: D19.P$1(A) Q23.3(D) R95.2
N$231: D19.P$2(C) R96.P$2
N$232: Q23.1(G) R94.P$1
N$233: D20.P$1(A) Q24.3(D) R99.2
N$234: D20.P$2(C) R100.P$2
N$235: Q24.1(G) R98.P$1
S1-B: R98.P$2 ; also sheet 1
S2-B: R86.P$2 ; also sheet 1
S3-B: R90.P$2 ; also sheet 1
S4-B: R70.P$2 ; also sheet 1
S5-B: R74.P$2 ; also sheet 1
S6-B: R94.P$2 ; also sheet 1
S7-B: R78.P$2 ; also sheet 1
S8-B: R82.P$2 ; also sheet 1
S9-B: R62.P$2 ; also sheet 1
S10-B: R66.P$2 ; also sheet 1

### Notes on the sheet
- TODO:  CHANGE ALL MOSFET VALUES
- TODO:  CHANGE PACKAGES ACCORDING TO DESIGN

## Sheet 5 of 5
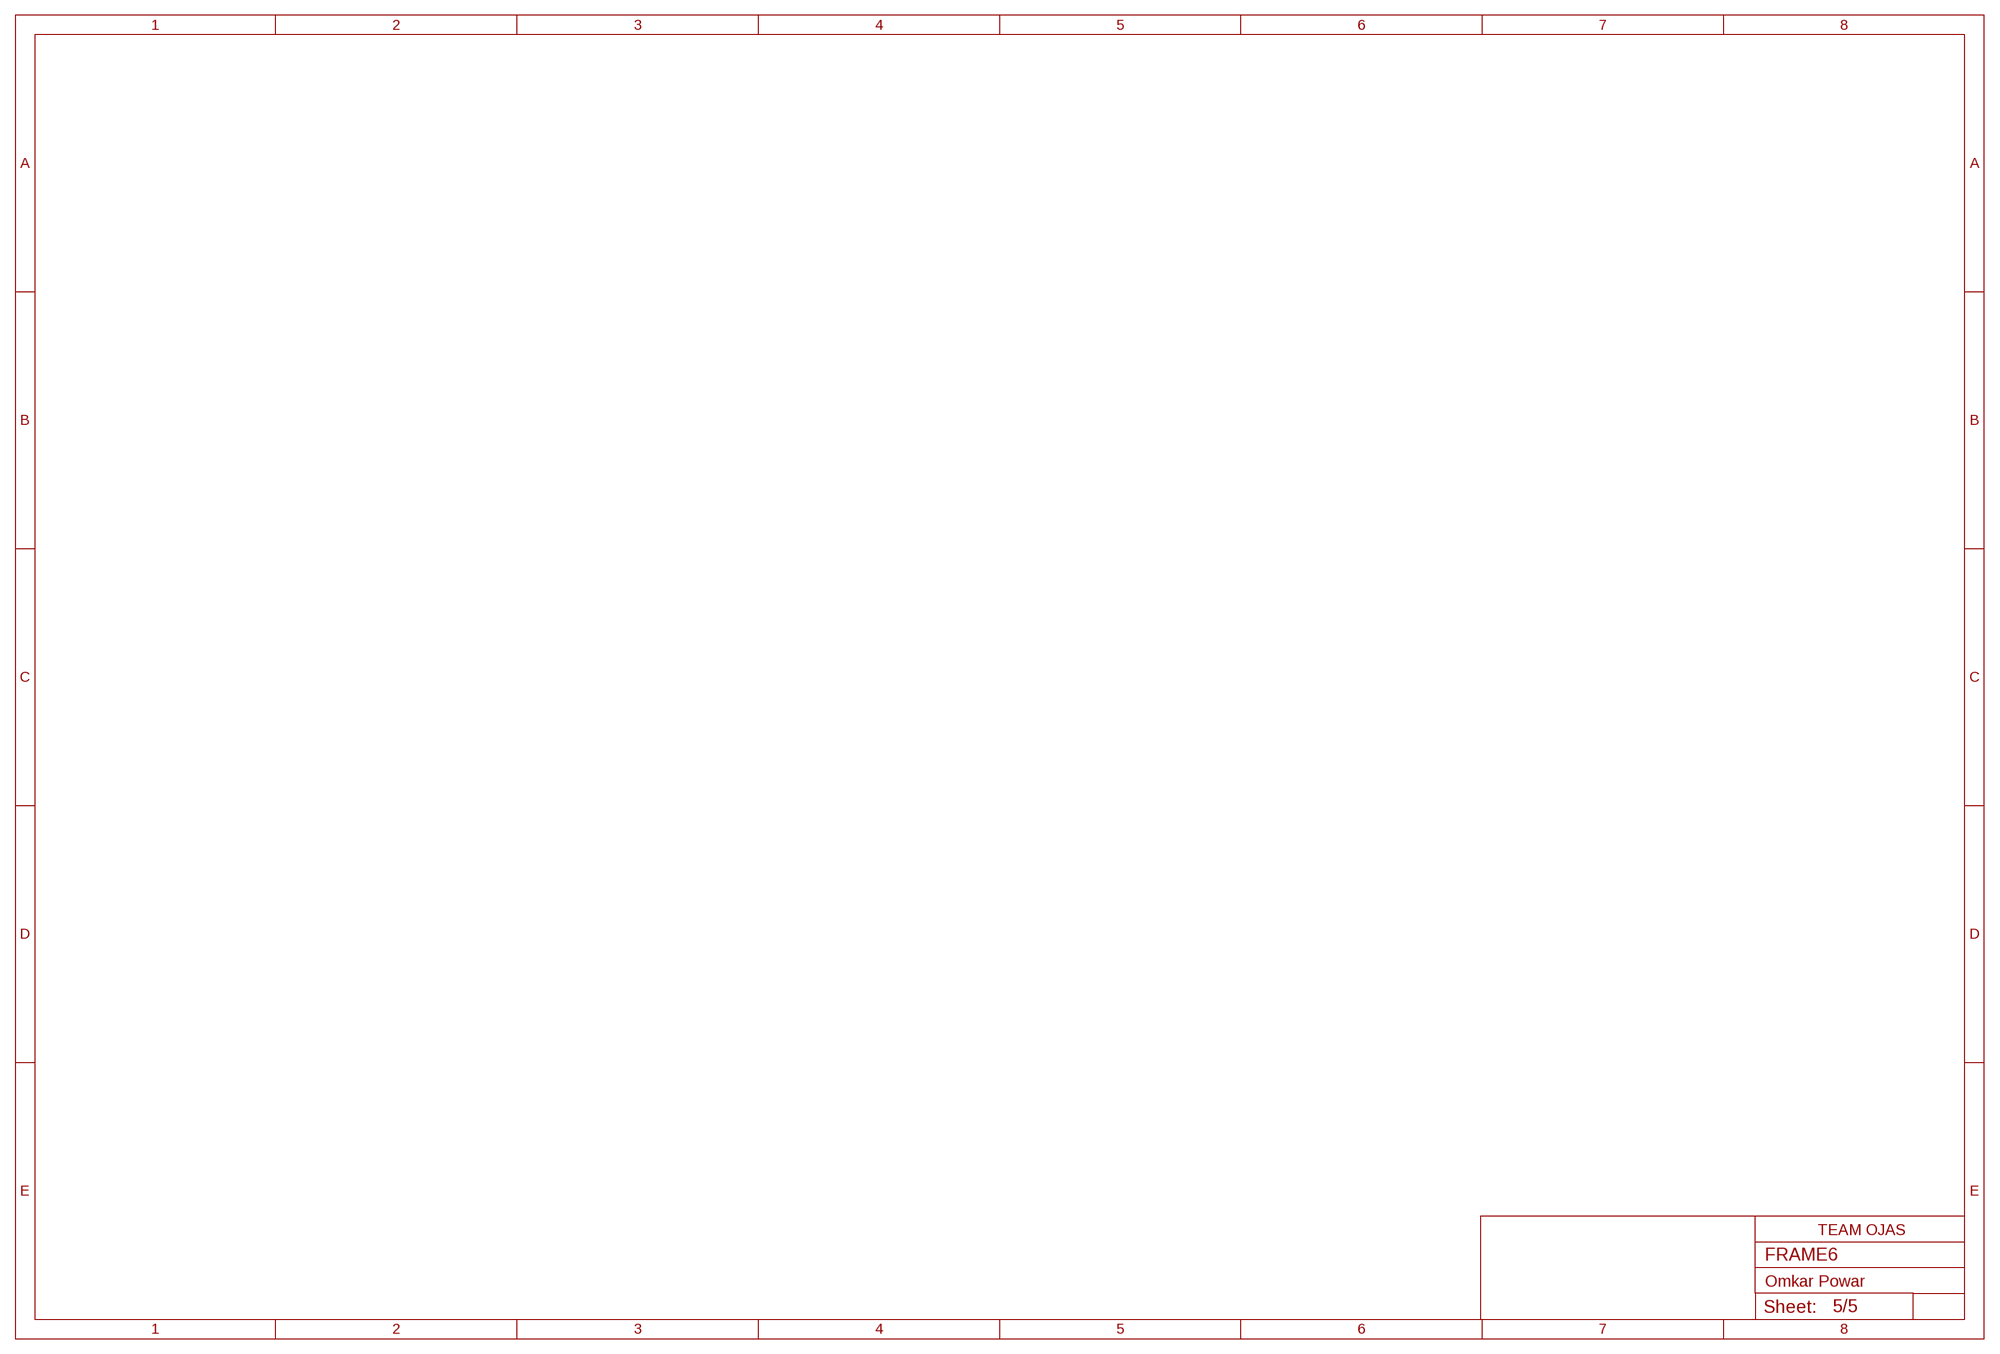
[diagram p4: schematic, sheet 5]

## Library data of the parts
C1-C56 = Team_Ojas_OVPowar:C
CNR1 CNR2 = Team_Ojas_OVPowar:CELL-CONNECTOR: BMS Cell Harness Connector, TH/.025 Connector System 1318772-2,
CNR3 CNR4 = Team_Ojas_OVPowar:COMM-CONNECTOR: BMS Communication Harness Connector NanoFit RA Hdr TH DR 12Ckt 0.38um Au Ntl
CNR6 CNR8 = Team_Ojas_OVPowar:TEMP-6-CONNECTOR
D1-D20 = Team_Ojas_OVPowar:LED
F1-F22 = Team_Ojas_OVPowar:F: FUSE SMD TYPE
Q1 Q14 = Team_Ojas_OVPowar:NSV1C201MZ4: NPN TRANSISTOR
Q2 Q13 = Team_Ojas_OVPowar:HM2101NL: Pulse Electronics Signal Transformers MDL SIN XFMR-CMC
Q3-Q12 Q15-Q24 = Team_Ojas_OVPowar:MOSFET-P_CHANNEL
R1-R110 = Team_Ojas_OVPowar:R
SJ1 SJ2 = jumper:SJ2W: SMD solder JUMPER
U1 U2 = Team_Ojas_OVPowar:LTC6804: Multicell Battery Monitors